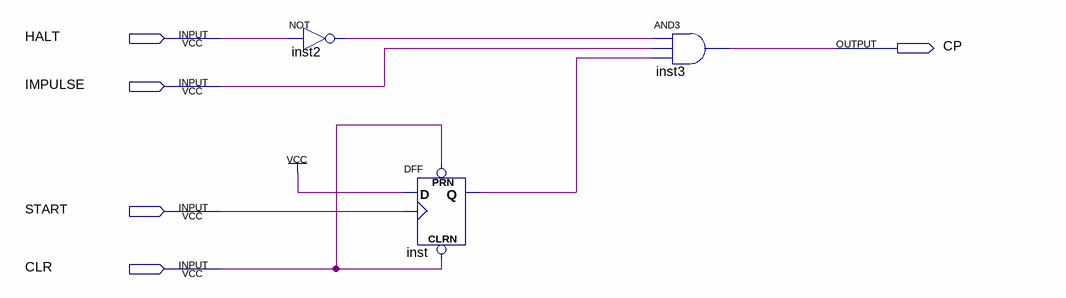
[diagram p0: schematic sheet]
// Quartus schematic my_start.bdf as structural Verilog: 3 symbols, 5 pins
module my_start (
  input  HALT,
  input  IMPULSE,
  input  START,
  input  CLR,
  output CP
);

  wire inst2_out, inst_q;

  not inst2 (inst2_out, HALT);
  DFF inst (.CLRN(CLR), .CLK(START), .D(1'b1), .PRN(CLR), .Q(inst_q));
  and inst3 (CP, inst2_out, IMPULSE, inst_q);
endmodule
